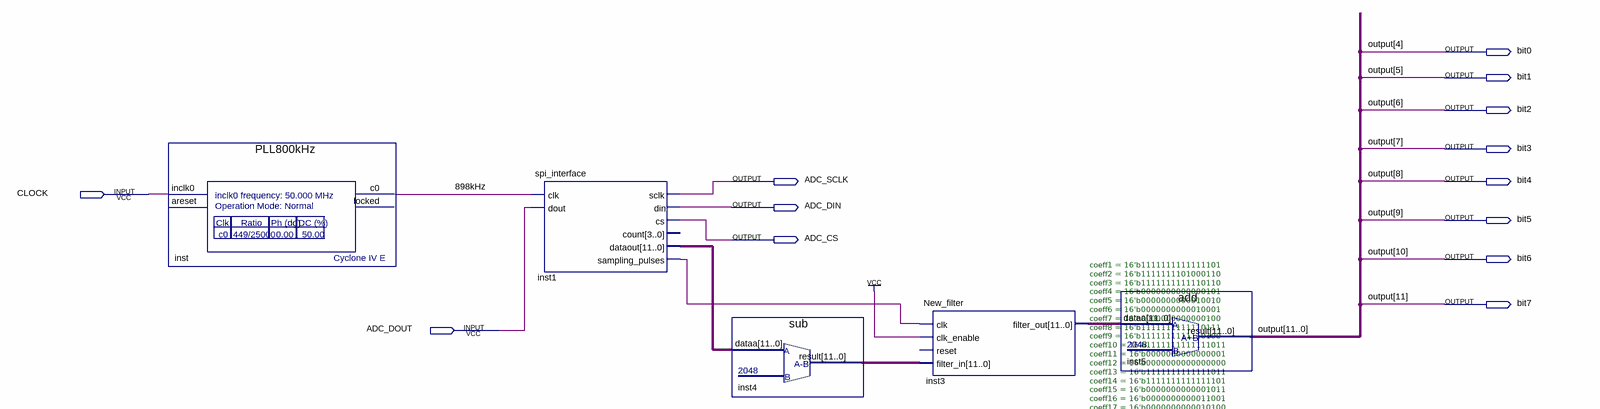
[diagram p0: schematic sheet]
// Quartus schematic ADC_digitising.bdf as structural Verilog: 5 symbols, 13 pins
module ADC_digitising (
  input  CLOCK,
  input  ADC_DOUT,
  output bit0,
  output bit1,
  output bit2,
  output bit3,
  output ADC_SCLK,
  output bit4,
  output ADC_DIN,
  output bit5,
  output ADC_CS,
  output bit6,
  output bit7
);

  wire \898kHz , inst1_sampling_pulses;
  wire [3:0] \output ;
  wire [11:0] inst1_dataout, inst3_filter_out, inst4_result;

  PLL800kHz inst (.inclk0(CLOCK), .c0(\898kHz ));  // open: areset, locked
  spi_interface inst1 (
    .clk(\898kHz ), .dout(ADC_DOUT), .sclk(ADC_SCLK), .din(ADC_DIN), .cs(ADC_CS), .dataout(inst1_dataout),
    .sampling_pulses(inst1_sampling_pulses));  // open: count
  sub inst4 (.dataa(inst1_dataout), .result(inst4_result));
  New_filter #(.coeff1(16'b1111111111111101), .coeff2(16'b1111111101000110), .coeff3(16'b1111111111110110), .coeff4(16'b0000000000000101), .coeff5(16'b0000000000010010), .coeff6(16'b0000000000010001), .coeff7(16'b0000000000000100), .coeff8(16'b1111111111110111), .coeff9(16'b1111111111110100), .coeff10(16'b1111111111111011), .coeff11(16'b0000000000000001), .coeff12(16'b0000000000000000), .coeff13(16'b1111111111111011), .coeff14(16'b1111111111111101), .coeff15(16'b0000000000001011), .coeff16(16'b0000000000011001), .coeff17(16'b0000000000010100), .coeff18(16'b1111111111110111), .coeff19(16'b1111111111010101), .coeff20(16'b1111111111001101), .coeff21(16'b1111111111110010), .coeff22(16'b0000000000101110), .coeff23(16'b0000000001010011), .coeff24(16'b0000000000111010), .coeff25(16'b1111111111101001), .coeff26(16'b1111111110011100), .coeff27(16'b1111111110010100), .coeff28(16'b1111111111100011), .coeff29(16'b0000000001010101), .coeff30(16'b0000000010010001), .coeff31(16'b0000000001011111), .coeff32(16'b1111111111011101), .coeff33(16'b1111111101101100), .coeff34(16'b1111111101101000), .coeff35(16'b1111111111011010), .coeff36(16'b0000000001101101), .coeff37(16'b0000000010110000), .coeff38(16'b0000000001101110), .coeff39(16'b1111111111011001), .coeff40(16'b1111111101100110), .coeff41(16'b1111111101101010), .coeff42(16'b1111111111011100), .coeff43(16'b0000000001011110), .coeff44(16'b0000000010001101), .coeff45(16'b0000000001010000), .coeff46(16'b1111111111100111), .coeff47(16'b1111111110101000), .coeff48(16'b1111111110111001), .coeff49(16'b1111111111110011), .coeff50(16'b0000000000010101), .coeff51(16'b0000000000001001), .coeff52(16'b1111111111110100), .coeff53(16'b0000000000001011), .coeff54(16'b0000000001001000), .coeff55(16'b0000000001100111), .coeff56(16'b0000000000100001), .coeff57(16'b1111111110001011), .coeff58(16'b1111111100011100), .coeff59(16'b1111111101011000), .coeff60(16'b0000000001000110), .coeff61(16'b0000000101000011), .coeff62(16'b0000000101101101), .coeff63(16'b0000000001100101), .coeff64(16'b1111111011000111), .coeff65(16'b1111110111011001), .coeff66(16'b1111111010001001), .coeff67(16'b0000000010010001), .coeff68(16'b0000001001111011), .coeff69(16'b0000001010101001), .coeff70(16'b0000000010110100), .coeff71(16'b1111110111101000), .coeff72(16'b1111110001110001), .coeff73(16'b1111110110101000), .coeff74(16'b0000000011100001), .coeff75(16'b0000001110111100), .coeff76(16'b0000001111100111), .coeff77(16'b0000000100000001), .coeff78(16'b1111110100010100), .coeff79(16'b1111101100100110), .coeff80(16'b1111110011100000), .coeff81(16'b0000000100100110), .coeff82(16'b0000010011000111), .coeff83(16'b0000010011100101), .coeff84(16'b0000000100111100), .coeff85(16'b1111110001111000), .coeff86(16'b1111101000111101), .coeff87(16'b1111110001011011), .coeff88(16'b0000000101010001), .coeff89(16'b0000010101100100), .coeff90(16'b0000010101101111), .coeff91(16'b0000000101011001), .coeff92(16'b1111110000110101), .coeff93(16'b0111100111101001), .coeff94(16'b1111110000110101), .coeff95(16'b0000000101011001), .coeff96(16'b0000010101101111), .coeff97(16'b0000010101100100), .coeff98(16'b0000000101010001), .coeff99(16'b1111110001011011), .coeff100(16'b1111101000111101), .coeff101(16'b1111110001111000), .coeff102(16'b0000000100111100), .coeff103(16'b0000010011100101), .coeff104(16'b0000010011000111), .coeff105(16'b0000000100100110), .coeff106(16'b1111110011100000), .coeff107(16'b1111101100100110), .coeff108(16'b1111110100010100), .coeff109(16'b0000000100000001), .coeff110(16'b0000001111100111), .coeff111(16'b0000001110111100), .coeff112(16'b0000000011100001), .coeff113(16'b1111110110101000), .coeff114(16'b1111110001110001), .coeff115(16'b1111110111101000), .coeff116(16'b0000000010110100), .coeff117(16'b0000001010101001), .coeff118(16'b0000001001111011), .coeff119(16'b0000000010010001), .coeff120(16'b1111111010001001), .coeff121(16'b1111110111011001), .coeff122(16'b1111111011000111), .coeff123(16'b0000000001100101), .coeff124(16'b0000000101101101), .coeff125(16'b0000000101000011), .coeff126(16'b0000000001000110), .coeff127(16'b1111111101011000), .coeff128(16'b1111111100011100), .coeff129(16'b1111111110001011), .coeff130(16'b0000000000100001), .coeff131(16'b0000000001100111), .coeff132(16'b0000000001001000), .coeff133(16'b0000000000001011), .coeff134(16'b1111111111110100), .coeff135(16'b0000000000001001), .coeff136(16'b0000000000010101), .coeff137(16'b1111111111110011), .coeff138(16'b1111111110111001), .coeff139(16'b1111111110101000), .coeff140(16'b1111111111100111), .coeff141(16'b0000000001010000), .coeff142(16'b0000000010001101), .coeff143(16'b0000000001011110), .coeff144(16'b1111111111011100), .coeff145(16'b1111111101101010), .coeff146(16'b1111111101100110), .coeff147(16'b1111111111011001), .coeff148(16'b0000000001101110), .coeff149(16'b0000000010110000), .coeff150(16'b0000000001101101), .coeff151(16'b1111111111011010), .coeff152(16'b1111111101101000), .coeff153(16'b1111111101101100), .coeff154(16'b1111111111011101), .coeff155(16'b0000000001011111), .coeff156(16'b0000000010010001), .coeff157(16'b0000000001010101), .coeff158(16'b1111111111100011), .coeff159(16'b1111111110010100), .coeff160(16'b1111111110011100), .coeff161(16'b1111111111101001), .coeff162(16'b0000000000111010), .coeff163(16'b0000000001010011), .coeff164(16'b0000000000101110), .coeff165(16'b1111111111110010), .coeff166(16'b1111111111001101), .coeff167(16'b1111111111010101), .coeff168(16'b1111111111110111), .coeff169(16'b0000000000010100), .coeff170(16'b0000000000011001), .coeff171(16'b0000000000001011), .coeff172(16'b1111111111111101), .coeff173(16'b1111111111111011), .coeff174(16'b0000000000000000), .coeff175(16'b0000000000000001), .coeff176(16'b1111111111111011), .coeff177(16'b1111111111110100), .coeff178(16'b1111111111110111), .coeff179(16'b0000000000000100), .coeff180(16'b0000000000010001), .coeff181(16'b0000000000010010), .coeff182(16'b0000000000000101), .coeff183(16'b1111111111110110), .coeff184(16'b1111111101000110), .coeff185(16'b1111111111111101)) inst3 (
    .clk(inst1_sampling_pulses), .clk_enable(1'b1), .filter_in(inst4_result), .filter_out(inst3_filter_out));  // open: reset
  add inst5 (.dataa(inst3_filter_out), .result({bit7, bit6, bit5, bit4, bit3, bit2, bit1, bit0, \output }));

  // Other names for the same wires on the sheet: output[11:4] = {bit7, bit6, bit5, bit4, bit3, bit2, bit1, bit0}
endmodule
